# Altium project PCB Project1.PrjPCB
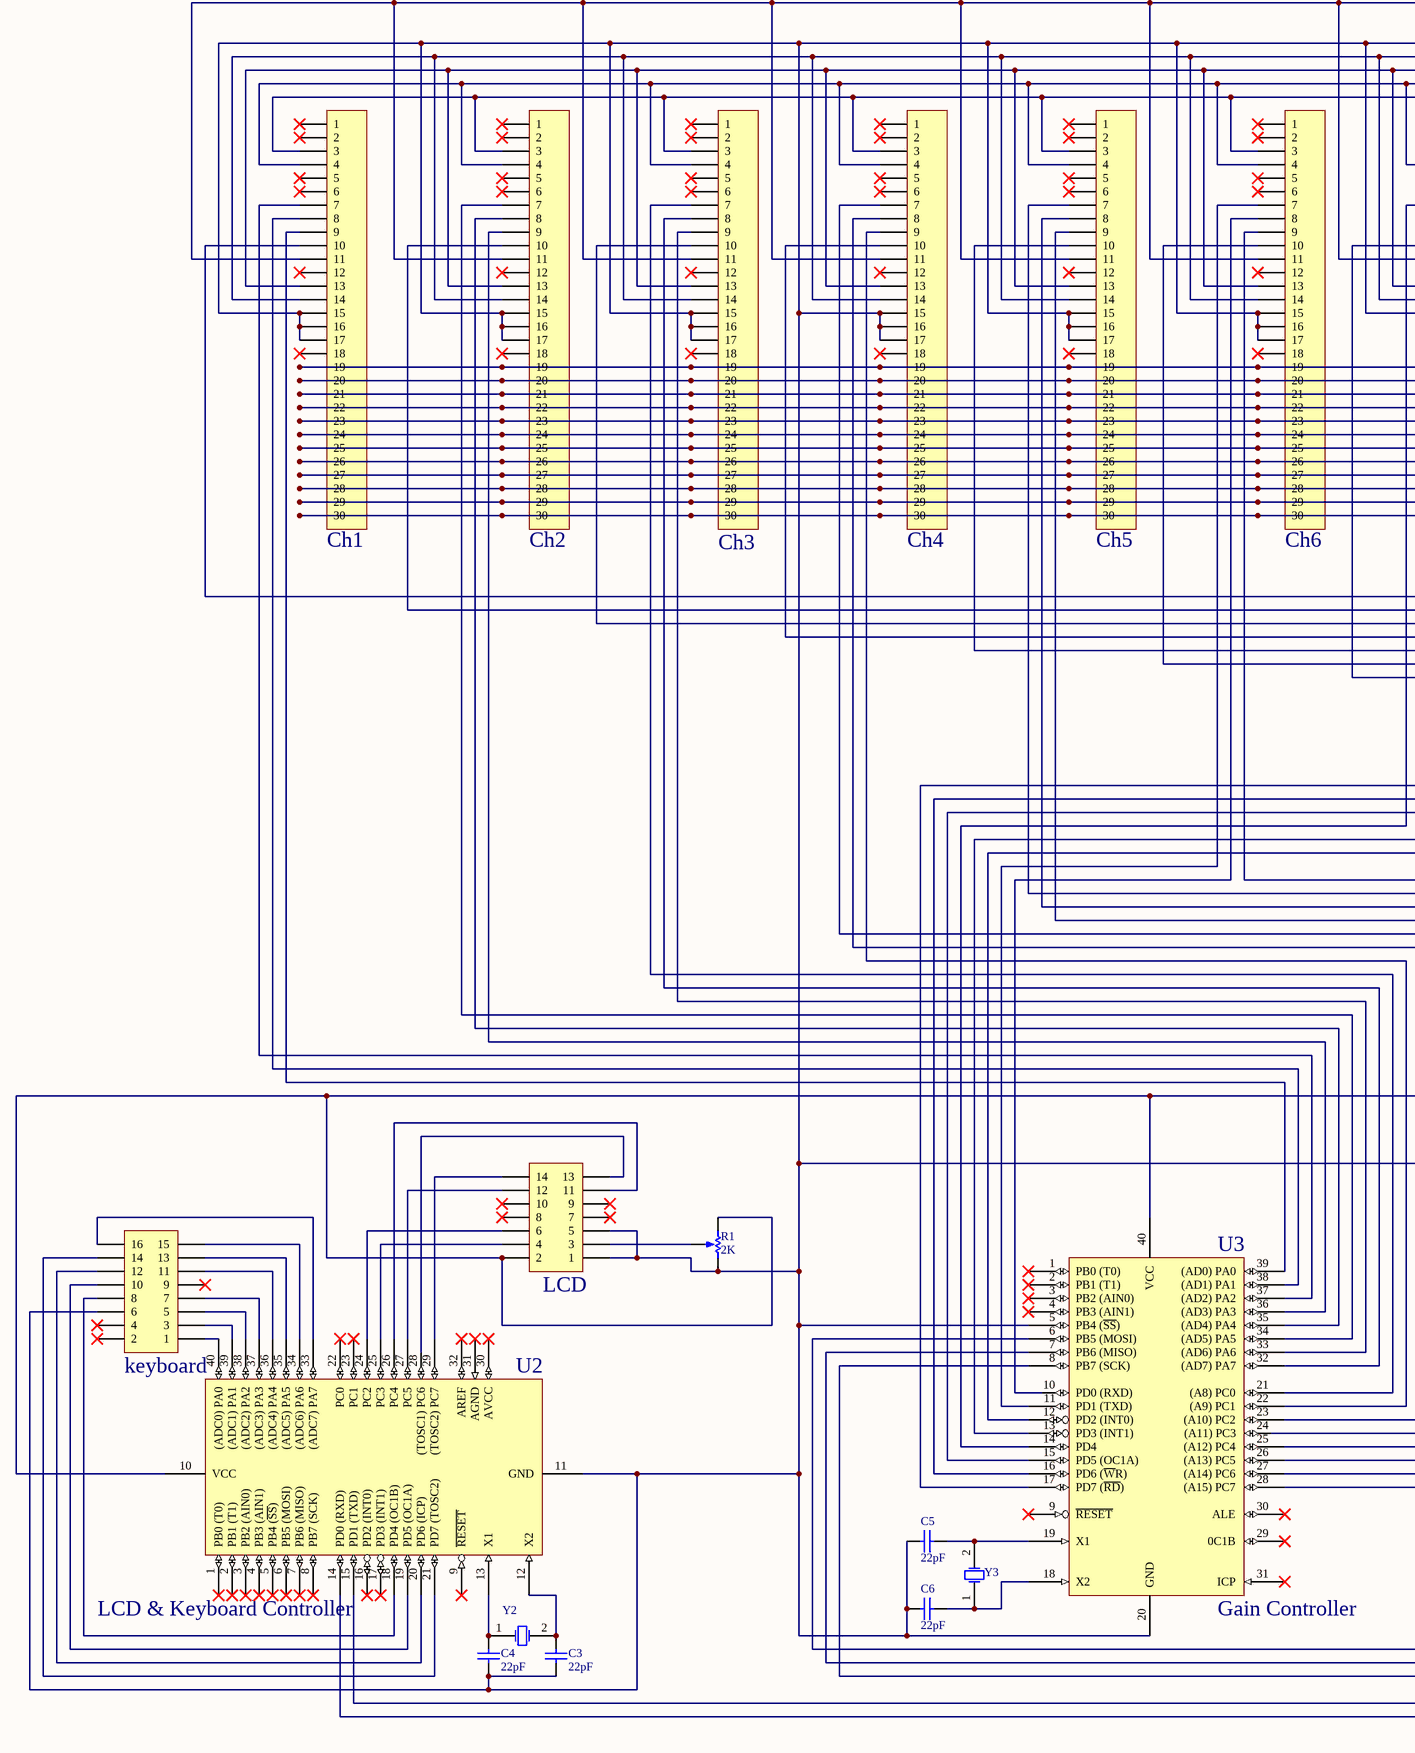
[diagram p0: Sheet1.SchDoc, left]
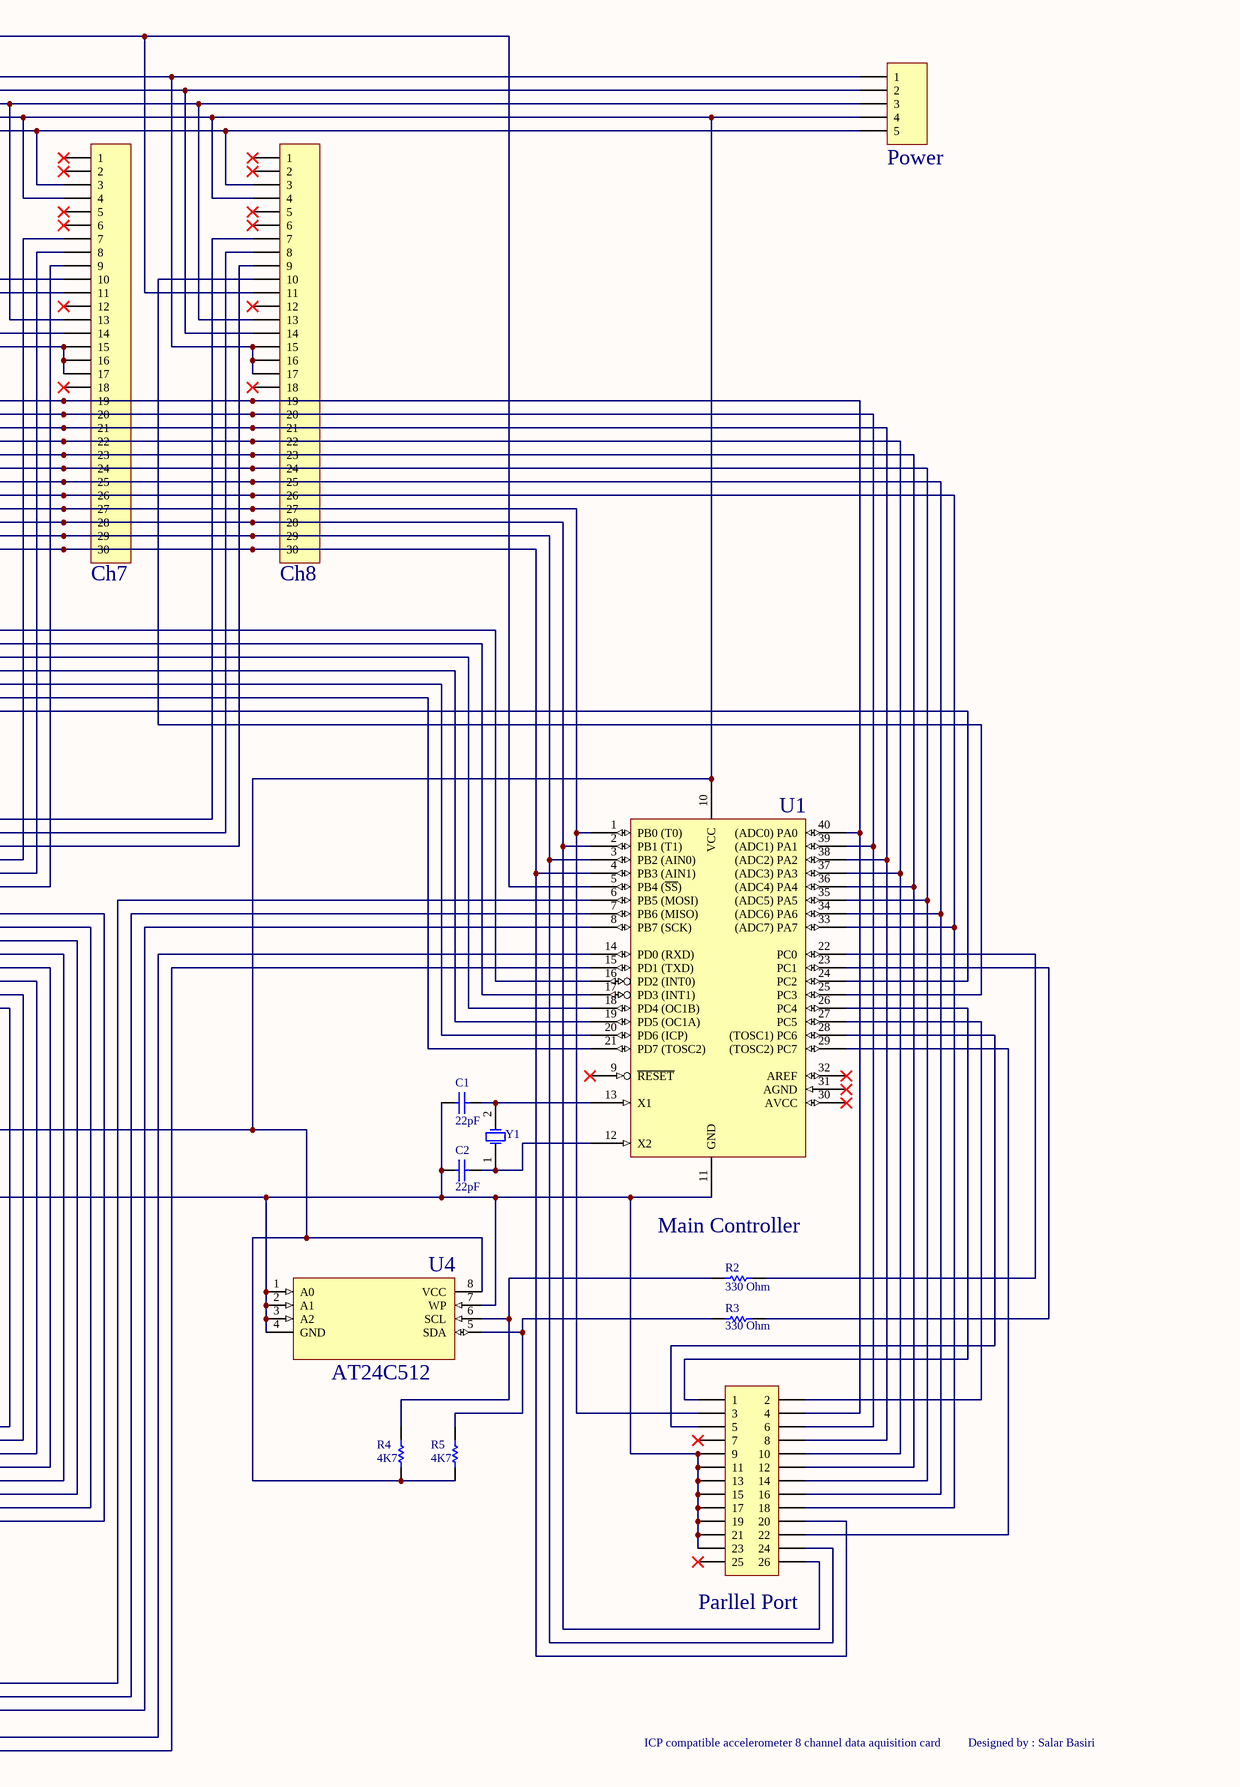
[diagram p1: Sheet1.SchDoc, middle]
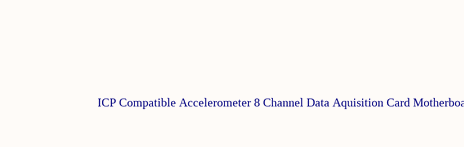
[diagram p2: Sheet1.SchDoc, right]
1 sheet, 30 parts. Net scope: global (net labels, ports and power ports of the same name join across sheets).
Board files: Mother_Board.PCBDOC, PCB1_b.PCBDOC, PCB3.PCBDOC, PCB4.PCBDOC

## Sheet Sheet1.SchDoc
size C

### Parts
C1  value 22pF  [RAD-0.1]
C2  value 22pF  [RAD-0.1]
C3  value 22pF  [RAD-0.1]
C4  value 22pF  [RAD-0.1]
C5  value 22pF  [RAD-0.1]
C6  value 22pF  [RAD-0.1]
Ch1  (no value)  [HDR1X30]
Ch2  (no value)  [HDR1X30]
Ch3  (no value)  [HDR1X30]
Ch4  (no value)  [HDR1X30]
Ch5  (no value)  [HDR1X30]
Ch6  (no value)  [HDR1X30]
Ch7  (no value)  [HDR1X30]
Ch8  (no value)  [HDR1X30]
keyboard  (no value)  [HDR2X8]
LCD  (no value)  [HDR2X7]
Parllel_Port  (no value)  [HDR2X13]
Power  (no value)  [HDR1X5]
R1  value 2K  [VR5]
R2  value 330 Ohm  [AXIAL-0.3]
R3  value 330 Ohm  [AXIAL-0.3]
R4  value 4K7  [AXIAL-0.3]
R5  value 4K7  [AXIAL-0.3]
U1  Part Field 1: Main Controller  [DIP-40]
U2  Part Field 1: LCD & Keyboard Controller  [DIP-40]
U3  Part Field 1: Gain Controller  [DIP-40]
U4  AT24C512  [DIP-8]
Y1  (no value)  [rad-0.2]
Y2  (no value)  [rad-0.2]
Y3  (no value)  [rad-0.2]

### Nets
NetC1_1: C1.1 C2.1 C3.1 C4.1 C5.1 C6.1 Ch1.15 Ch1.16 Ch1.17 Ch2.15 Ch2.16 Ch2.17 Ch3.15 Ch3.16 Ch3.17 Ch4.15 Ch4.16 Ch4.17 Ch5.15 Ch5.16 Ch5.17 Ch6.15 Ch6.16 Ch6.17 Ch7.15 Ch7.16 Ch7.17 Ch8.15 Ch8.16 Ch8.17 keyboard.6 LCD.1 LCD.5 Parllel_Port.9 Parllel_Port.11 Parllel_Port.13 Parllel_Port.15 Parllel_Port.17 Parllel_Port.19 Parllel_Port.21 Parllel_Port.23 Power.1 R1.2(BOT) U1.11(GND) U2.11(GND) U3.5(PB4_(~{SS})) U3.20(GND) U4.1(A0) U4.2(A1) U4.3(A2) U4.4(GND) U4.7(WP)
NetC1_2: C1.2 U1.13(X1) Y1.2(OSC2)
NetC2_2: C2.2 U1.12(X2) Y1.1(OSC1)
NetC3_2: C3.2 U2.12(X2) Y2.2(OSC2)
NetC4_2: C4.2 U2.13(X1) Y2.1(OSC1)
NetC5_2: C5.2 U3.19(X1) Y3.2(OSC2)
NetC6_2: C6.2 U3.18(X2) Y3.1(OSC1)
NetCh1_3: Ch1.3 Ch2.3 Ch3.3 Ch4.3 Ch5.3 Ch6.3 Ch7.3 Ch8.3 Power.5
NetCh1_4: Ch1.4 Ch2.4 Ch3.4 Ch4.4 Ch5.4 Ch6.4 Ch7.4 Ch8.4 LCD.2 Power.4 R1.1(TOP) R4.1 R5.1 U1.10(VCC) U2.10(VCC) U3.40(VCC) U4.8(VCC)
NetCh1_7: Ch1.7 U3.37((AD2)_PA2)
NetCh1_8: Ch1.8 U3.38((AD1)_PA1)
NetCh1_9: Ch1.9 U3.39((AD0)_PA0)
NetCh1_10: Ch1.10 U1.16(PD2_(INT0))
NetCh1_11: Ch1.11 Ch2.11 Ch3.11 Ch4.11 Ch5.11 Ch6.11 Ch7.11 Ch8.11 U1.5(PB4_(~{SS}))
NetCh1_13: Ch1.13 Ch2.13 Ch3.13 Ch4.13 Ch5.13 Ch6.13 Ch7.13 Ch8.13 Power.3
NetCh1_14: Ch1.14 Ch2.14 Ch3.14 Ch4.14 Ch5.14 Ch6.14 Ch7.14 Ch8.14 Power.2
NetCh1_19: Ch1.19 Ch2.19 Ch3.19 Ch4.19 Ch5.19 Ch6.19 Ch7.19 Ch8.19 Parllel_Port.4 U1.40((ADC0)_PA0)
NetCh1_20: Ch1.20 Ch2.20 Ch3.20 Ch4.20 Ch5.20 Ch6.20 Ch7.20 Ch8.20 Parllel_Port.6 U1.39((ADC1)_PA1)
NetCh1_21: Ch1.21 Ch2.21 Ch3.21 Ch4.21 Ch5.21 Ch6.21 Ch7.21 Ch8.21 Parllel_Port.8 U1.38((ADC2)_PA2)
NetCh1_22: Ch1.22 Ch2.22 Ch3.22 Ch4.22 Ch5.22 Ch6.22 Ch7.22 Ch8.22 Parllel_Port.10 U1.37((ADC3)_PA3)
NetCh1_23: Ch1.23 Ch2.23 Ch3.23 Ch4.23 Ch5.23 Ch6.23 Ch7.23 Ch8.23 Parllel_Port.12 U1.36((ADC4)_PA4)
NetCh1_24: Ch1.24 Ch2.24 Ch3.24 Ch4.24 Ch5.24 Ch6.24 Ch7.24 Ch8.24 Parllel_Port.14 U1.35((ADC5)_PA5)
NetCh1_25: Ch1.25 Ch2.25 Ch3.25 Ch4.25 Ch5.25 Ch6.25 Ch7.25 Ch8.25 Parllel_Port.16 U1.34((ADC6)_PA6)
NetCh1_26: Ch1.26 Ch2.26 Ch3.26 Ch4.26 Ch5.26 Ch6.26 Ch7.26 Ch8.26 Parllel_Port.18 U1.33((ADC7)_PA7)
NetCh1_27: Ch1.27 Ch2.27 Ch3.27 Ch4.27 Ch5.27 Ch6.27 Ch7.27 Ch8.27 Parllel_Port.3 U1.1(PB0_(T0))
NetCh1_28: Ch1.28 Ch2.28 Ch3.28 Ch4.28 Ch5.28 Ch6.28 Ch7.28 Ch8.28 Parllel_Port.26 U1.2(PB1_(T1))
NetCh1_29: Ch1.29 Ch2.29 Ch3.29 Ch4.29 Ch5.29 Ch6.29 Ch7.29 Ch8.29 Parllel_Port.24 U1.3(PB2_(AIN0))
NetCh1_30: Ch1.30 Ch2.30 Ch3.30 Ch4.30 Ch5.30 Ch6.30 Ch7.30 Ch8.30 Parllel_Port.20 U1.4(PB3_(AIN1))
NetCh2_7: Ch2.7 U3.34((AD5)_PA5)
NetCh2_8: Ch2.8 U3.35((AD4)_PA4)
NetCh2_9: Ch2.9 U3.36((AD3)_PA3)
NetCh2_10: Ch2.10 U1.17(PD3_(INT1))
NetCh3_7: Ch3.7 U3.21((A8)_PC0)
NetCh3_8: Ch3.8 U3.32((AD7)_PA7)
NetCh3_9: Ch3.9 U3.33((AD6)_PA6)
NetCh3_10: Ch3.10 U1.18(PD4_(OC1B))
NetCh4_7: Ch4.7 U3.24((A11)_PC3)
NetCh4_8: Ch4.8 U3.23((A10)_PC2)
NetCh4_9: Ch4.9 U3.22((A9)_PC1)
NetCh4_10: Ch4.10 U1.19(PD5_(OC1A))
NetCh5_7: Ch5.7 U3.27((A14)_PC6)
NetCh5_8: Ch5.8 U3.26((A13)_PC5)
NetCh5_9: Ch5.9 U3.25((A12)_PC4)
NetCh5_10: Ch5.10 U1.20(PD6_(ICP))
NetCh6_7: Ch6.7 U3.11(PD1_(TXD))
NetCh6_8: Ch6.8 U3.10(PD0_(RXD))
NetCh6_9: Ch6.9 U3.28((A15)_PC7)
NetCh6_10: Ch6.10 U1.21(PD7_(TOSC2))
NetCh7_7: Ch7.7 U3.14(PD4)
NetCh7_8: Ch7.8 U3.13(PD3_(INT1))
NetCh7_9: Ch7.9 U3.12(PD2_(INT0))
NetCh7_10: Ch7.10 U1.24(PC2)
NetCh8_7: Ch8.7 U3.17(PD7_(~{RD}))
NetCh8_8: Ch8.8 U3.16(PD6_(~{W}R))
NetCh8_9: Ch8.9 U3.15(PD5_(OC1A))
NetCh8_10: Ch8.10 U1.25(PC3)
Netkeyboard_1: keyboard.1 U2.40((ADC0)_PA0)
Netkeyboard_3: keyboard.3 U2.39((ADC1)_PA1)
Netkeyboard_5: keyboard.5 U2.38((ADC2)_PA2)
Netkeyboard_7: keyboard.7 U2.37((ADC3)_PA3)
Netkeyboard_8: keyboard.8 U2.18(PD4_(OC1B))
Netkeyboard_10: keyboard.10 U2.19(PD5_(OC1A))
Netkeyboard_11: keyboard.11 U2.36((ADC4)_PA4)
Netkeyboard_12: keyboard.12 U2.20(PD6_(ICP))
Netkeyboard_13: keyboard.13 U2.35((ADC5)_PA5)
Netkeyboard_14: keyboard.14 U2.21(PD7_(TOSC2))
Netkeyboard_15: keyboard.15 U2.34((ADC6)_PA6)
Netkeyboard_16: keyboard.16 U2.33((ADC7)_PA7)
NetLCD_3: LCD.3 R1.3(TAP)
NetLCD_4: LCD.4 U2.25(PC3)
NetLCD_6: LCD.6 U2.24(PC2)
NetLCD_11: LCD.11 U2.26(PC4)
NetLCD_12: LCD.12 U2.27(PC5)
NetLCD_13: LCD.13 U2.28((TOSC1)_PC6)
NetLCD_14: LCD.14 U2.29((TOSC2)_PC7)
NetParllel_Port_1: Parllel_Port.1 U1.26(PC4)
NetParllel_Port_2: Parllel_Port.2 U1.27(PC5)
NetParllel_Port_5: Parllel_Port.5 U1.28((TOSC1)_PC6)
NetParllel_Port_22: Parllel_Port.22 U1.29((TOSC2)_PC7)
NetR2_1: R2.1 R4.2 U4.6(SCL)
NetR2_2: R2.2 U1.22(PC0)
NetR3_1: R3.1 R5.2 U4.5(SDA)
NetR3_2: R3.2 U1.23(PC1)
NetU1_6: U1.6(PB5_(MOSI)) U3.6(PB5_(MOSI))
NetU1_7: U1.7(PB6_(MISO)) U3.7(PB6_(MISO))
NetU1_8: U1.8(PB7_(SCK)) U3.8(PB7_(SCK))
NetU1_14: U1.14(PD0_(RXD)) U2.15(PD1_(TXD))
NetU1_15: U1.15(PD1_(TXD)) U2.14(PD0_(RXD))

Not connected (* = marked no-connect by the designer): Ch1 1* 2* 5* 6* 12* 18*; Ch2 1* 2* 5* 6* 12* 18*; Ch3 1* 2* 5* 6* 12* 18*; Ch4 1* 2* 5* 6* 12* 18*; Ch5 1* 2* 5* 6* 12* 18*; Ch6 1* 2* 5* 6* 12* 18*; Ch7 1* 2* 5* 6* 12* 18*; Ch8 1* 2* 5* 6* 12* 18*; keyboard 2* 4* 9*; LCD 7* 8* 9* 10*; Parllel_Port 7* 25*; U1 9(~{RESET})* 30(AVCC)* 31(AGND)* 32(AREF)*; U2 1(PB0_(T0))* 2(PB1_(T1))* 3(PB2_(AIN0))* 4(PB3_(AIN1))* 5(PB4_(~{SS}))* 6(PB5_(MOSI))* 7(PB6_(MISO))* 8(PB7_(SCK))* 9(~{RESET})* 16(PD2_(INT0))* 17(PD3_(INT1))* 22(PC0)* 23(PC1)* 30(AVCC)* 31(AGND)* 32(AREF)*; U3 1(PB0_(T0))* 2(PB1_(T1))* 3(PB2_(AIN0))* 4(PB3_(AIN1))* 9(~{RESET})* 29(0C1B)* 30(ALE)* 31(ICP)*

### Notes on the sheet
- ICP compatible accelerometer 8 channel data aquisition card
- Designed by : Salar Basiri
- ICP Compatible Accelerometer 8 Channel Data Aquisition Card Motherboard Designed By Salar Basiri

### Library data of the parts
C1-C6 = Cap: Capacitor; Manufacturer: Generic Components; Class: Passive; Published: 08/06/2000; Publisher: Altium Hobart Technology Centre; SubClass: Capacitor
Ch1-Ch8 = Header 30: Header, 30-Pin; Manufacturer: Generic Components; Class: Connector
keyboard = Header 8X2: Header, 8-Pin, Dual row; Manufacturer: Generic Components; Class: Connector
LCD = Header 7X2: Header, 7-Pin, Dual row; Manufacturer: Generic Components; Class: Connector
Parllel_Port = Header 13X2: Header, 13-Pin, Dual row; Manufacturer: Generic Components; Class: Connector
Power = Header 5: Header, 5-Pin; Manufacturer: Generic Components; Class: Connector
R1 = RPot1: Potentiometer; Manufacturer: Generic Components; Class: Passive; Set Position: 0.5; Published: 08/06/2000; Publisher: Altium Hobart Technology Centre; SubClass: Potentiometer
R2-R5 = Res1: Resistor; Manufacturer: Generic Components; Class: Passive; Published: 08/06/2000; Publisher: Altium Hobart Technology Centre; SubClass: Resistor
U1 U2 = ATMEGA32_DIP40: Atmel Microcontroller - Library created by carel..  <www.mpfreezone.com>
U3 = ATMEGA8515_DIP40: Atmel Microcontroller - Library created by carel..  <www.mpfreezone.com>
U4 = AT24C512: Serial EEPROM 512KBit Memory; Manufacturer: Atmel; Published: 15/04/2002; Publisher: Altium Hobart Technology Centre; Class: Memory; SubClass: EEPROM
Y1-Y3 = XTAL: Crystal Oscillator; Manufacturer: Generic Components; Published: 08/06/2000; Publisher: Altium Hobart Technology Centre; Class: Oscillator; SubClass: Crystal Oscillator